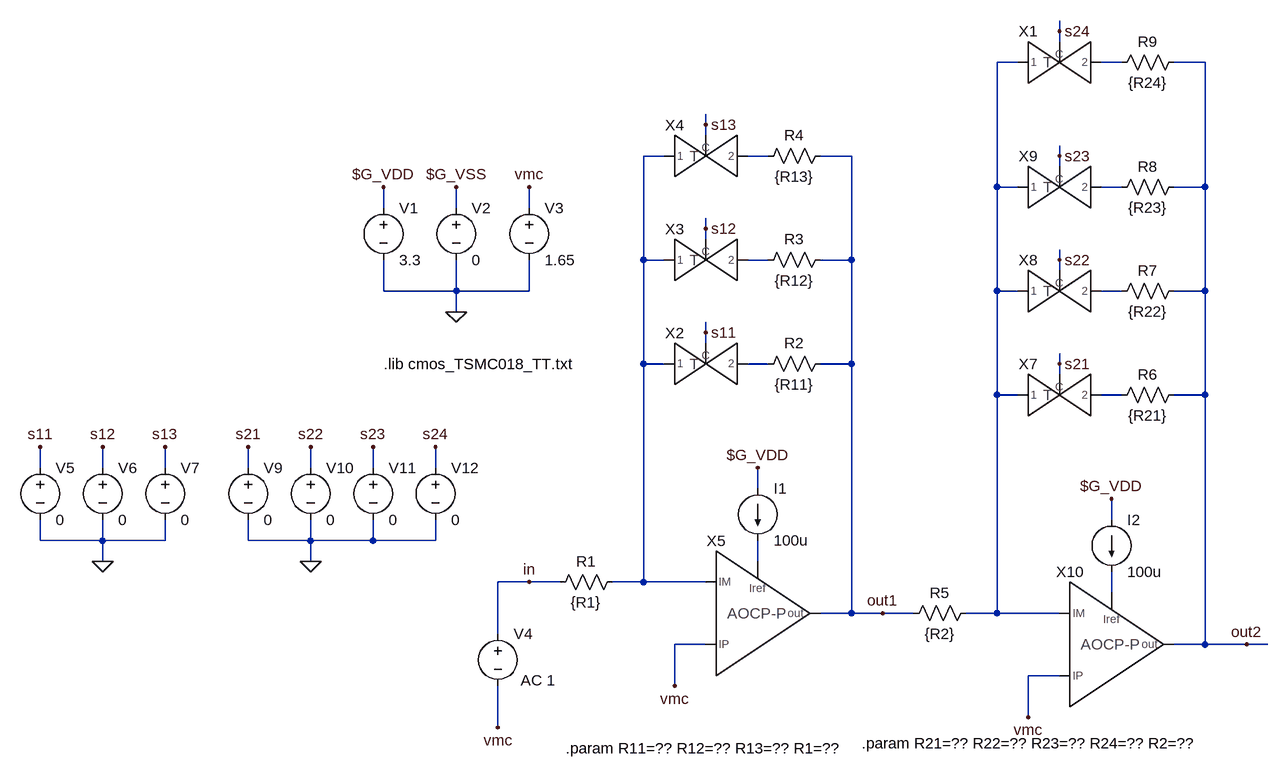
[diagram p0: schematic test_pga2.asc]
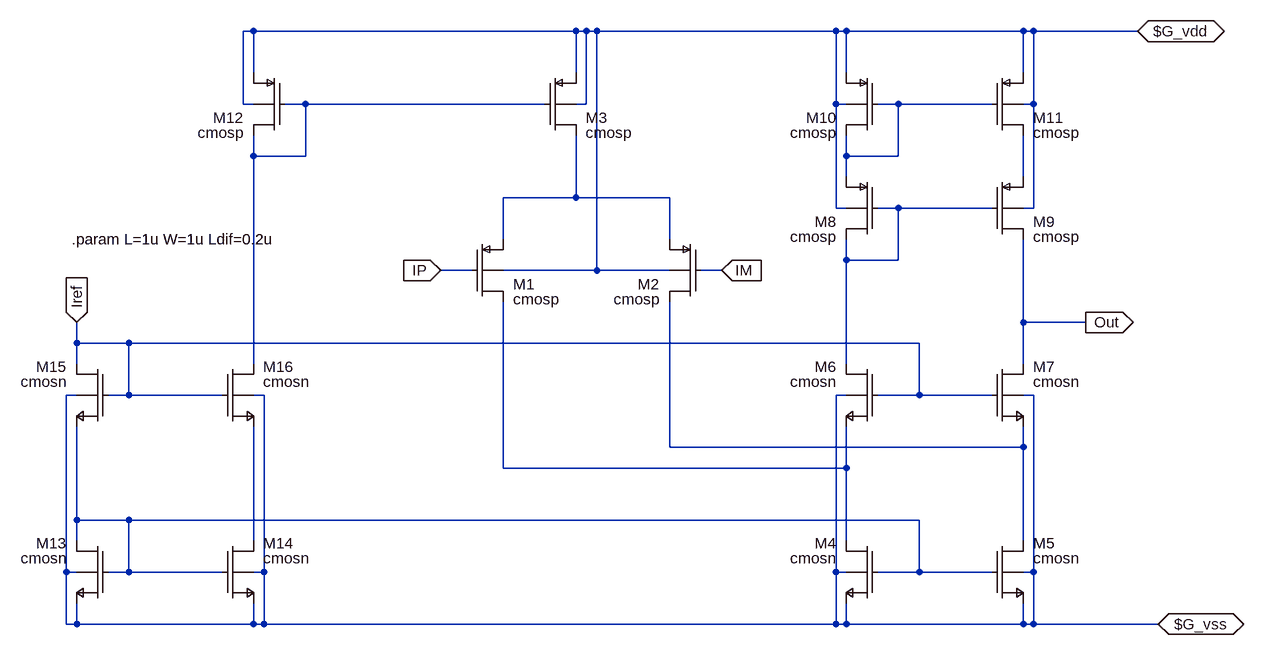
[diagram p1: sub-circuit ao_cp_p.asc]
test_pga2.asc, the LTspice schematic file:
Version 4
SHEET 1 2632 1328
WIRE 1248 -16 1248 -32
WIRE 1248 0 1248 -16
WIRE 1184 32 1152 32
WIRE 1344 32 1312 32
WIRE 1472 32 1424 32
WIRE 704 128 704 112
WIRE 704 144 704 128
WIRE 640 176 608 176
WIRE 800 176 768 176
WIRE 928 176 880 176
WIRE 1248 176 1248 160
WIRE 1248 192 1248 176
WIRE 1152 224 1152 32
WIRE 1184 224 1152 224
WIRE 1344 224 1312 224
WIRE 1472 224 1472 32
WIRE 1472 224 1424 224
WIRE 208 256 208 224
WIRE 320 256 320 224
WIRE 432 256 432 224
WIRE 704 288 704 272
WIRE 704 304 704 288
WIRE 608 336 608 176
WIRE 640 336 608 336
WIRE 800 336 768 336
WIRE 928 336 928 176
WIRE 928 336 880 336
WIRE 1248 336 1248 320
WIRE 1248 352 1248 336
WIRE 208 384 208 336
WIRE 320 384 320 336
WIRE 320 384 208 384
WIRE 432 384 432 336
WIRE 432 384 320 384
WIRE 1152 384 1152 224
WIRE 1184 384 1152 384
WIRE 1344 384 1312 384
WIRE 1472 384 1472 224
WIRE 1472 384 1424 384
WIRE 320 416 320 384
WIRE 704 448 704 432
WIRE 704 464 704 448
WIRE 608 496 608 336
WIRE 640 496 608 496
WIRE 800 496 768 496
WIRE 928 496 928 336
WIRE 928 496 880 496
WIRE 1248 496 1248 480
WIRE 1248 512 1248 496
WIRE 1152 544 1152 384
WIRE 1184 544 1152 544
WIRE 1344 544 1312 544
WIRE 1472 544 1472 384
WIRE 1472 544 1424 544
WIRE -320 656 -320 624
WIRE -224 656 -224 624
WIRE -128 656 -128 624
WIRE 0 656 0 624
WIRE 96 656 96 624
WIRE 192 656 192 624
WIRE 288 656 288 624
WIRE 784 688 784 656
WIRE 1328 736 1328 704
WIRE -320 768 -320 736
WIRE -224 768 -224 736
WIRE -224 768 -320 768
WIRE -128 768 -128 736
WIRE -128 768 -224 768
WIRE 0 768 0 736
WIRE 96 768 96 736
WIRE 96 768 0 768
WIRE 192 768 192 736
WIRE 192 768 96 768
WIRE 288 768 288 736
WIRE 288 768 192 768
WIRE -224 800 -224 768
WIRE 96 800 96 768
WIRE 784 800 784 768
WIRE 432 832 384 832
WIRE 480 832 432 832
WIRE 608 832 608 496
WIRE 608 832 560 832
WIRE 704 832 608 832
WIRE 1328 848 1328 816
WIRE 928 880 928 496
WIRE 928 880 880 880
WIRE 976 880 928 880
WIRE 1024 880 976 880
WIRE 1152 880 1152 544
WIRE 1152 880 1104 880
WIRE 1248 880 1152 880
WIRE 384 912 384 832
WIRE 704 928 656 928
WIRE 1472 928 1472 544
WIRE 1472 928 1424 928
WIRE 1536 928 1472 928
WIRE 1568 928 1536 928
WIRE 1248 976 1200 976
WIRE 656 992 656 928
WIRE 1200 1040 1200 976
WIRE 384 1056 384 992
FLAG 320 416 0
FLAG 208 224 $G_VDD
FLAG 320 224 $G_VSS
FLAG 432 224 vmc
FLAG 656 992 vmc
FLAG 1200 1040 vmc
FLAG 976 880 out1
FLAG 1536 928 out2
FLAG 704 448 s11
FLAG 704 288 s12
FLAG 704 128 s13
FLAG 1248 496 s21
FLAG 1248 336 s22
FLAG 1248 176 s23
FLAG -320 624 s11
FLAG 432 832 in
FLAG -224 624 s12
FLAG -128 624 s13
FLAG 0 624 s21
FLAG 96 624 s22
FLAG 192 624 s23
FLAG -224 800 0
FLAG 96 800 0
FLAG 384 1056 vmc
FLAG 784 656 $G_VDD
FLAG 1328 704 $G_VDD
FLAG 1248 -16 s24
FLAG 288 624 s24
SYMBOL voltage 384 896 R0
WINDOW 3 32 121 Left 2
WINDOW 123 35 87 Left 2
WINDOW 39 0 0 Left 0
SYMATTR Value ""
SYMATTR Value2 AC 1
SYMATTR InstName V4
SYMBOL voltage 208 240 R0
WINDOW 123 0 0 Left 2
WINDOW 39 0 0 Left 2
SYMATTR InstName V1
SYMATTR Value 3.3
SYMBOL voltage 320 240 R0
WINDOW 123 0 0 Left 2
WINDOW 39 0 0 Left 2
SYMATTR InstName V2
SYMATTR Value 0
SYMBOL voltage 432 240 R0
WINDOW 123 0 0 Left 2
WINDOW 39 0 0 Left 2
SYMATTR InstName V3
SYMATTR Value 1.65
SYMBOL res 576 816 R90
WINDOW 0 0 56 VBottom 2
WINDOW 3 32 56 VTop 2
SYMATTR InstName R1
SYMATTR Value {R1}
SYMBOL res 896 480 R90
WINDOW 0 0 56 VBottom 2
WINDOW 3 32 56 VTop 2
SYMATTR InstName R2
SYMATTR Value {R11}
SYMBOL com_tgate 720 496 R0
SYMATTR InstName X2
SYMBOL res 896 320 R90
WINDOW 0 0 56 VBottom 2
WINDOW 3 32 56 VTop 2
SYMATTR InstName R3
SYMATTR Value {R12}
SYMBOL com_tgate 720 336 R0
SYMATTR InstName X3
SYMBOL res 896 160 R90
WINDOW 0 0 56 VBottom 2
WINDOW 3 32 56 VTop 2
SYMATTR InstName R4
SYMATTR Value {R13}
SYMBOL com_tgate 720 176 R0
SYMATTR InstName X4
SYMBOL res 1120 864 R90
WINDOW 0 0 56 VBottom 2
WINDOW 3 32 56 VTop 2
SYMATTR InstName R5
SYMATTR Value {R2}
SYMBOL current 784 688 R0
WINDOW 123 0 0 Left 0
WINDOW 39 0 0 Left 0
SYMATTR InstName I1
SYMATTR Value 100u
SYMBOL res 1440 528 R90
WINDOW 0 0 56 VBottom 2
WINDOW 3 32 56 VTop 2
SYMATTR InstName R6
SYMATTR Value {R21}
SYMBOL res 1440 368 R90
WINDOW 0 0 56 VBottom 2
WINDOW 3 32 56 VTop 2
SYMATTR InstName R7
SYMATTR Value {R22}
SYMBOL com_tgate 1264 544 R0
SYMATTR InstName X7
SYMBOL res 1440 208 R90
WINDOW 0 0 56 VBottom 2
WINDOW 3 32 56 VTop 2
SYMATTR InstName R8
SYMATTR Value {R23}
SYMBOL com_tgate 1264 384 R0
SYMATTR InstName X8
SYMBOL com_tgate 1264 224 R0
SYMATTR InstName X9
SYMBOL voltage -320 640 R0
WINDOW 123 0 0 Left 0
WINDOW 39 0 0 Left 0
SYMATTR InstName V5
SYMATTR Value 0
SYMBOL voltage -224 640 R0
WINDOW 123 0 0 Left 0
WINDOW 39 0 0 Left 0
SYMATTR InstName V6
SYMATTR Value 0
SYMBOL voltage -128 640 R0
WINDOW 123 0 0 Left 0
WINDOW 39 0 0 Left 0
SYMATTR InstName V7
SYMATTR Value 0
SYMBOL voltage 0 640 R0
WINDOW 123 0 0 Left 0
WINDOW 39 0 0 Left 0
SYMATTR InstName V9
SYMATTR Value 0
SYMBOL voltage 96 640 R0
WINDOW 123 0 0 Left 0
WINDOW 39 0 0 Left 0
SYMATTR InstName V10
SYMATTR Value 0
SYMBOL voltage 192 640 R0
WINDOW 123 0 0 Left 0
WINDOW 39 0 0 Left 0
SYMATTR InstName V11
SYMATTR Value 0
SYMBOL ao_cp_p 752 880 R0
SYMATTR InstName X5
SYMBOL ao_cp_p 1296 928 R0
SYMATTR InstName X10
SYMBOL current 1328 736 R0
WINDOW 123 0 0 Left 0
WINDOW 39 0 0 Left 0
SYMATTR InstName I2
SYMATTR Value 100u
SYMBOL res 1440 16 R90
WINDOW 0 0 56 VBottom 2
WINDOW 3 32 56 VTop 2
SYMATTR InstName R9
SYMATTR Value {R24}
SYMBOL com_tgate 1264 32 R0
SYMATTR InstName X1
SYMBOL voltage 288 640 R0
WINDOW 123 0 0 Left 0
WINDOW 39 0 0 Left 0
SYMATTR InstName V12
SYMATTR Value 0
TEXT 208 496 Left 2 !.lib cmos_TSMC018_TT.txt
TEXT 488 1088 Left 2 !.param R11=?? R12=?? R13=?? R1=??
TEXT 944 1080 Left 2 !.param R21=?? R22=?? R23=?? R24=?? R2=??

ao_cp_p.asc, the sub-circuit schematic file:
Version 4
SHEET 1 2836 1240
WIRE 512 -432 496 -432
WIRE 1008 -432 512 -432
WIRE 1024 -432 1008 -432
WIRE 1040 -432 1024 -432
WIRE 1408 -432 1040 -432
WIRE 1424 -432 1408 -432
WIRE 1696 -432 1424 -432
WIRE 1712 -432 1696 -432
WIRE 1872 -432 1712 -432
WIRE 512 -368 512 -432
WIRE 1008 -368 1008 -432
WIRE 1424 -368 1424 -432
WIRE 1696 -368 1696 -432
WIRE 496 -320 496 -432
WIRE 512 -320 496 -320
WIRE 592 -320 560 -320
WIRE 960 -320 592 -320
WIRE 1024 -320 1024 -432
WIRE 1024 -320 1008 -320
WIRE 1408 -320 1408 -432
WIRE 1424 -320 1408 -320
WIRE 1504 -320 1472 -320
WIRE 1648 -320 1504 -320
WIRE 1712 -320 1712 -432
WIRE 1712 -320 1696 -320
WIRE 512 -240 512 -272
WIRE 592 -240 592 -320
WIRE 592 -240 512 -240
WIRE 1424 -240 1424 -272
WIRE 1504 -240 1504 -320
WIRE 1504 -240 1424 -240
WIRE 1424 -208 1424 -240
WIRE 1696 -208 1696 -272
WIRE 1008 -176 1008 -272
WIRE 1008 -176 896 -176
WIRE 1152 -176 1008 -176
WIRE 1408 -160 1408 -320
WIRE 1424 -160 1408 -160
WIRE 1504 -160 1472 -160
WIRE 1648 -160 1504 -160
WIRE 1712 -160 1712 -320
WIRE 1712 -160 1696 -160
WIRE 896 -112 896 -176
WIRE 1152 -112 1152 -176
WIRE 1424 -80 1424 -112
WIRE 1504 -80 1504 -160
WIRE 1504 -80 1424 -80
WIRE 848 -64 800 -64
WIRE 1040 -64 1040 -432
WIRE 1040 -64 896 -64
WIRE 1152 -64 1040 -64
WIRE 1232 -64 1200 -64
WIRE 1696 16 1696 -112
WIRE 1792 16 1696 16
WIRE 240 48 240 16
WIRE 320 48 240 48
WIRE 1536 48 320 48
WIRE 240 80 240 48
WIRE 512 80 512 -240
WIRE 1424 80 1424 -80
WIRE 1696 80 1696 16
WIRE 240 128 224 128
WIRE 320 128 320 48
WIRE 320 128 288 128
WIRE 464 128 320 128
WIRE 528 128 512 128
WIRE 1424 128 1408 128
WIRE 1536 128 1536 48
WIRE 1536 128 1472 128
WIRE 1648 128 1536 128
WIRE 1712 128 1696 128
WIRE 1152 208 1152 -16
WIRE 1696 208 1696 176
WIRE 1696 208 1152 208
WIRE 896 240 896 -16
WIRE 1424 240 1424 176
WIRE 1424 240 896 240
WIRE 240 320 240 176
WIRE 320 320 240 320
WIRE 1536 320 320 320
WIRE 240 352 240 320
WIRE 512 352 512 176
WIRE 1424 352 1424 240
WIRE 1696 352 1696 208
WIRE 224 400 224 128
WIRE 240 400 224 400
WIRE 320 400 320 320
WIRE 320 400 288 400
WIRE 464 400 320 400
WIRE 528 400 528 128
WIRE 528 400 512 400
WIRE 1408 400 1408 128
WIRE 1424 400 1408 400
WIRE 1536 400 1536 320
WIRE 1536 400 1472 400
WIRE 1648 400 1536 400
WIRE 1712 400 1712 128
WIRE 1712 400 1696 400
WIRE 224 480 224 400
WIRE 240 480 240 448
WIRE 240 480 224 480
WIRE 512 480 512 448
WIRE 512 480 240 480
WIRE 528 480 528 400
WIRE 528 480 512 480
WIRE 1408 480 1408 400
WIRE 1408 480 528 480
WIRE 1424 480 1424 448
WIRE 1424 480 1408 480
WIRE 1696 480 1696 448
WIRE 1696 480 1424 480
WIRE 1712 480 1712 400
WIRE 1712 480 1696 480
WIRE 1904 480 1712 480
FLAG 800 -64 IP
IOPIN 800 -64 In
FLAG 1792 16 Out
IOPIN 1792 16 Out
FLAG 1232 -64 IM
IOPIN 1232 -64 In
FLAG 1872 -432 $G_vdd
IOPIN 1872 -432 BiDir
FLAG 1904 480 $G_vss
IOPIN 1904 480 BiDir
FLAG 240 16 Iref
IOPIN 240 16 In
SYMBOL pmosb 848 -112 R0
SYMATTR InstName M1
SYMATTR Value cmosp
SYMATTR Value2 l={L} w={W} ad={Ldif*W} as={Ldif*W} pd={(Ldif+W)*2} ps={(Ldif+W)*2} m=120
SYMBOL pmosb 1200 -112 M0
SYMATTR InstName M2
SYMATTR Value cmosp
SYMATTR Value2 l={L} w={W} ad={Ldif*W} as={Ldif*W} pd={(Ldif+W)*2} ps={(Ldif+W)*2} m=120
SYMBOL pmosb 960 -368 R0
SYMATTR InstName M3
SYMATTR Value cmosp
SYMATTR Value2 l={L} w={W} ad={Ldif*W} as={Ldif*W} pd={(Ldif+W)*2} ps={(Ldif+W)*2} m=152
SYMBOL nmosb 1472 352 M0
SYMATTR InstName M4
SYMATTR Value cmosn
SYMATTR Value2 l={L} w={W} ad={Ldif*W} as={Ldif*W} pd={(Ldif+W)*2} ps={(Ldif+W)*2} m=39.7
SYMBOL nmosb 1648 352 R0
SYMATTR InstName M5
SYMATTR Value cmosn
SYMATTR Value2 l={L} w={W} ad={Ldif*W} as={Ldif*W} pd={(Ldif+W)*2} ps={(Ldif+W)*2} m=39.7
SYMBOL nmosb 1472 80 M0
SYMATTR InstName M6
SYMATTR Value cmosn
SYMATTR Value2 l={L} w={W} ad={Ldif*W} as={Ldif*W} pd={(Ldif+W)*2} ps={(Ldif+W)*2} m=23.8
SYMBOL nmosb 1648 80 R0
SYMATTR InstName M7
SYMATTR Value cmosn
SYMATTR Value2 l={L} w={W} ad={Ldif*W} as={Ldif*W} pd={(Ldif+W)*2} ps={(Ldif+W)*2} m=23.8
SYMBOL pmosb 1472 -208 M0
SYMATTR InstName M8
SYMATTR Value cmosp
SYMATTR Value2 l={L} w={W} ad={Ldif*W} as={Ldif*W} pd={(Ldif+W)*2} ps={(Ldif+W)*2} m=114
SYMBOL pmosb 1648 -208 R0
SYMATTR InstName M9
SYMATTR Value cmosp
SYMATTR Value2 l={L} w={W} ad={Ldif*W} as={Ldif*W} pd={(Ldif+W)*2} ps={(Ldif+W)*2} m=114
SYMBOL pmosb 1472 -368 M0
SYMATTR InstName M10
SYMATTR Value cmosp
SYMATTR Value2 l={L} w={W} ad={Ldif*W} as={Ldif*W} pd={(Ldif+W)*2} ps={(Ldif+W)*2} m=114
SYMBOL pmosb 1648 -368 R0
SYMATTR InstName M11
SYMATTR Value cmosp
SYMATTR Value2 l={L} w={W} ad={Ldif*W} as={Ldif*W} pd={(Ldif+W)*2} ps={(Ldif+W)*2} m=114
SYMBOL pmosb 560 -368 M0
SYMATTR InstName M12
SYMATTR Value cmosp
SYMATTR Value2 l={L} w={W} ad={Ldif*W} as={Ldif*W} pd={(Ldif+W)*2} ps={(Ldif+W)*2} m=56.2
SYMBOL nmosb 288 352 M0
SYMATTR InstName M13
SYMATTR Value cmosn
SYMATTR Value2 l={L} w={W} ad={Ldif*W} as={Ldif*W} pd={(Ldif+W)*2} ps={(Ldif+W)*2} m=11.8
SYMBOL nmosb 464 352 R0
SYMATTR InstName M14
SYMATTR Value cmosn
SYMATTR Value2 l={L} w={W} ad={Ldif*W} as={Ldif*W} pd={(Ldif+W)*2} ps={(Ldif+W)*2} m=11.8
SYMBOL nmosb 288 80 M0
SYMATTR InstName M15
SYMATTR Value cmosn
SYMATTR Value2 l={L} w={W} ad={Ldif*W} as={Ldif*W} pd={(Ldif+W)*2} ps={(Ldif+W)*2} m=11.8
SYMBOL nmosb 464 80 R0
SYMATTR InstName M16
SYMATTR Value cmosn
SYMATTR Value2 l={L} w={W} ad={Ldif*W} as={Ldif*W} pd={(Ldif+W)*2} ps={(Ldif+W)*2} m=11.8
TEXT 232 -112 Left 2 !.param L=1u W=1u Ldif=0.2u

The netlist it stands for:
* test_pga2.asc
V4 in vmc AC 1
V1 $G_VDD 0 3.3
V2 $G_VSS 0 0
V3 vmc 0 1.65
R1 N003 in {R1}
R2 out1 N008 {R11}
XX2 N003 s11 N008 com_tgate  ; pins 1 C 2
R3 out1 N006 {R12}
XX3 N003 s12 N006 com_tgate  ; pins 1 C 2
R4 out1 N004 {R13}
XX4 N003 s13 N004 com_tgate  ; pins 1 C 2
R5 N001 out1 {R2}
I1 $G_VDD N010 100u
R6 out2 N009 {R21}
R7 out2 N007 {R22}
XX7 N001 s21 N009 com_tgate  ; pins 1 C 2
R8 out2 N005 {R23}
XX8 N001 s22 N007 com_tgate  ; pins 1 C 2
XX9 N001 s23 N005 com_tgate  ; pins 1 C 2
V5 s11 0 0
V6 s12 0 0
V7 s13 0 0
V9 s21 0 0
V10 s22 0 0
V11 s23 0 0
XX5 N003 vmc out1 N010 ao_cp_p
XX10 N001 vmc out2 N011 ao_cp_p
I2 $G_VDD N011 100u
R9 out2 N002 {R24}
XX1 N001 s24 N002 com_tgate  ; pins 1 C 2
V12 s24 0 0

* block symbol definitions
.subckt ao_cp_p IM IP out Iref
M1 N007 IP N004 $G_vdd cmosp l={L} w={W} ad={Ldif*W} as={Ldif*W} pd={(Ldif+W)*2} ps={(Ldif+W)*2} m=120
M2 N006 IM N004 $G_vdd cmosp l={L} w={W} ad={Ldif*W} as={Ldif*W} pd={(Ldif+W)*2} ps={(Ldif+W)*2} m=120
M3 N004 N001 $G_vdd $G_vdd cmosp l={L} w={W} ad={Ldif*W} as={Ldif*W} pd={(Ldif+W)*2} ps={(Ldif+W)*2} m=152
M4 N007 N008 $G_vss $G_vss cmosn l={L} w={W} ad={Ldif*W} as={Ldif*W} pd={(Ldif+W)*2} ps={(Ldif+W)*2} m=39.7
M5 N006 N008 $G_vss $G_vss cmosn l={L} w={W} ad={Ldif*W} as={Ldif*W} pd={(Ldif+W)*2} ps={(Ldif+W)*2} m=39.7
M6 N005 Iref N007 $G_vss cmosn l={L} w={W} ad={Ldif*W} as={Ldif*W} pd={(Ldif+W)*2} ps={(Ldif+W)*2} m=23.8
M7 Out Iref N006 $G_vss cmosn l={L} w={W} ad={Ldif*W} as={Ldif*W} pd={(Ldif+W)*2} ps={(Ldif+W)*2} m=23.8
M8 N005 N005 N002 $G_vdd cmosp l={L} w={W} ad={Ldif*W} as={Ldif*W} pd={(Ldif+W)*2} ps={(Ldif+W)*2} m=114
M9 Out N005 N003 $G_vdd cmosp l={L} w={W} ad={Ldif*W} as={Ldif*W} pd={(Ldif+W)*2} ps={(Ldif+W)*2} m=114
M10 N002 N002 $G_vdd $G_vdd cmosp l={L} w={W} ad={Ldif*W} as={Ldif*W} pd={(Ldif+W)*2} ps={(Ldif+W)*2} m=114
M11 N003 N002 $G_vdd $G_vdd cmosp l={L} w={W} ad={Ldif*W} as={Ldif*W} pd={(Ldif+W)*2} ps={(Ldif+W)*2} m=114
M12 N001 N001 $G_vdd $G_vdd cmosp l={L} w={W} ad={Ldif*W} as={Ldif*W} pd={(Ldif+W)*2} ps={(Ldif+W)*2} m=56.2
M13 N008 N008 $G_vss $G_vss cmosn l={L} w={W} ad={Ldif*W} as={Ldif*W} pd={(Ldif+W)*2} ps={(Ldif+W)*2} m=11.8
M14 N009 N008 $G_vss $G_vss cmosn l={L} w={W} ad={Ldif*W} as={Ldif*W} pd={(Ldif+W)*2} ps={(Ldif+W)*2} m=11.8
M15 Iref Iref N008 $G_vss cmosn l={L} w={W} ad={Ldif*W} as={Ldif*W} pd={(Ldif+W)*2} ps={(Ldif+W)*2} m=11.8
M16 N001 Iref N009 $G_vss cmosn l={L} w={W} ad={Ldif*W} as={Ldif*W} pd={(Ldif+W)*2} ps={(Ldif+W)*2} m=11.8
.param L=1u W=1u Ldif=0.2u
.ends ao_cp_p

.model NMOS NMOS
.model PMOS PMOS
.lib standard.mos
.lib cmos_TSMC018_TT.txt
.param R11=?? R12=?? R13=?? R1=??
.param R21=?? R22=?? R23=?? R24=?? R2=??
.backanno
.end